# EasyEDA schematic SCH_Guava PCB.json
TITLE: Schematic; REV: 1.0; Date: 2022-01-08; Sheet: 1/1; Drawn By: PedroElFrijol; Company: Guava
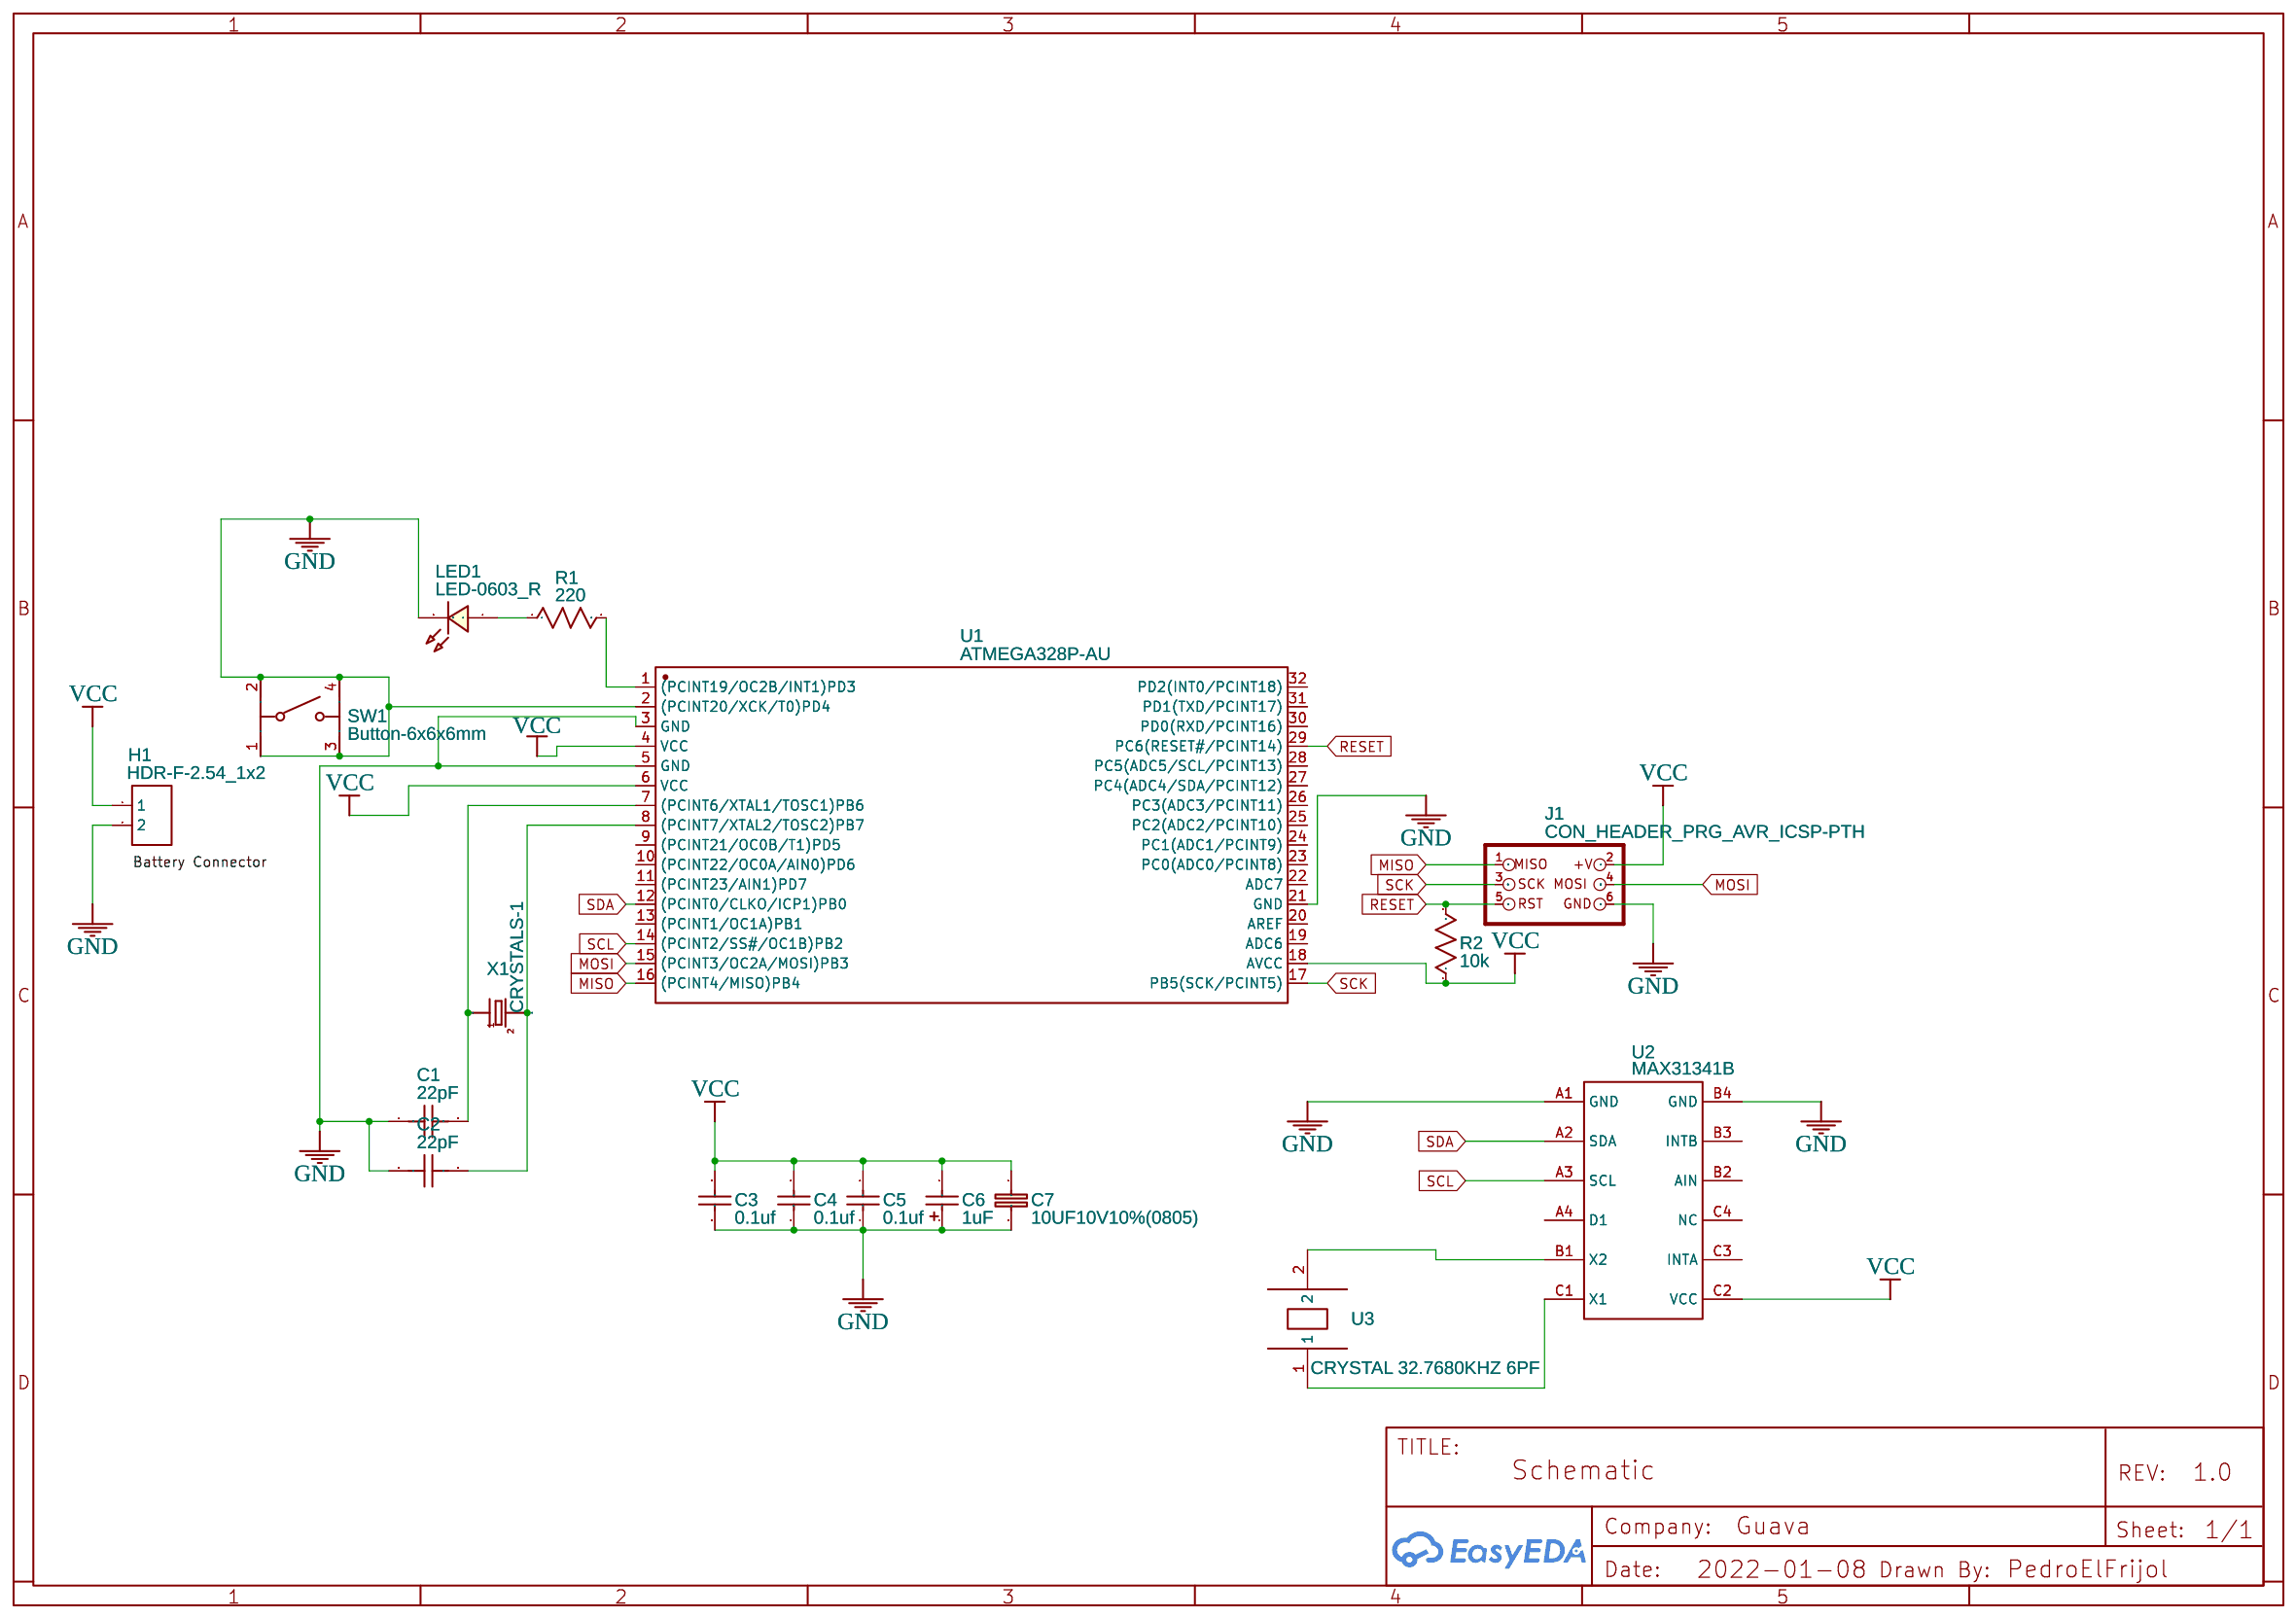
[diagram p0: schematic sheet]

## Parts
C1  22pF  [C0603]
C2  22pF  [C0603]
C3  0.1uf  [0805]
C4  0.1uf  [0805]
C5  0.1uf  [0805]
C6  1uF  [0805]
C7  10UF10V10%(0805)  [C0805]
H1  HDR-F-2.54_1x2  [HDR-F-2.54_1X2]
J1  CON_HEADER_PRG_AVR_ICSP-PTH  [HEADER_PRG_2X03]
LED1  LED-0603_R  [LED0603_RED]
R1  220  [R0603]
R2  10k  [R0603]
SW1  Button-6x6x6mm  [SW-TH_4P-L6.0-W6.0-P4.50-LS6.1]
U1  ATMEGA328P-AU  [TQFP-32_L7.0-W7.0-P0.80-LS9.0-BL]
U2  MAX31341B  [12-WLP]
U3  CRYSTAL 32.7680KHZ 6PF  [32.768KHZ CRYSTAL]
X1  CRYSTALS-1  [HCM49]

## Library data of the parts
C1 C2 = C_0603_US: Contributor: LCEDA_Lib
C3-C5 = 0.1uf: Supplier Part: undefined; Supplier: LCSC; Manufacturer: LCSC; Manufacturer Part: CT4-0805Y104M500
C6 = 1uF: Supplier: LCSC; Manufacturer: AVX; Manufacturer Part: TAP105K050SCS; Supplier Part: C52309
C7 = 10UF10V10%(0805): CAP-11330; Contributor: SparkFun
H1 = HDR-F-2.54_1x2: Supplier Part: C49661; Supplier: LCSC; Contributor: LCEDA_Lib
J1 = CON_HEADER_PRG_AVR_ICSP-PTH: 2x3 AVR ICSP programming header; Contributor: DangerousPrototype
LED1 = LED-0603_R: Manufacturer: EVERLIGHT(台湾亿光); Manufacturer Part: 19-217/R6C-AL1M2VY/3T; Supplier Part: C72044; Supplier: LCSC; Contributor: LCEDA_01
R1 R2 = R_0603_US: Contributor: LCEDA_Lib
SW1 = Button-6x6x6mm: Supplier Part: C71836; Supplier: LCSC; Manufacturer: BBJ; Manufacturer Part: Switch,6*6*6Plastic head,260G, 0.25mm,Straight line
U1 = ATMEGA328P-AU: Supplier: LCSC; Manufacturer: MICROCHIP; Supplier Part: C14877; JLCPCB Part Class: Basic Part
U2 = MAX31341B: Manufacturer: Maxim Integrated; Manufacturer Part: MAX31341BEWC+; Supplier: Digi-Key; Supplier Part: MAX31341BEWC+-ND; link: https://www.digikey.com/product-detail/en/maxim-integrated/MAX31341BEWC/MAX31341BEWC-ND/10258733; Contributor: bradbock
U3 = CRYSTAL 32.7680KHZ 6PF T/H: Manufacturer: Citizen Finedevice Co Ltd; Manufacturer Part: CFS-20632768DZBB; Supplier: Digi-Key; Supplier Part: 300-8301-ND; link: https://www.digikey.com/product-detail/en/citizen-finedevice-co-ltd/CFS-20632768DZBB/300-8301-ND/862578; Contributor: mneal
X1 = CRYSTALS-1

## Nets
GND: C1.1 C2.1 C3.1 C4.1 C5.1 C6.1 C7.2 H1.2 J1.6(GND) LED1.2 SW1.1 SW1.2 SW1.3 SW1.4 U1.2((PCINT20/XCK/T0)PD4) U1.3(GND) U1.5(GND) U1.21(GND) U2.A1(GND) U2.B4(GND)
VCC: C3.2 C4.2 C5.2 C6.2 C7.1 H1.1 J1.2(+V) R2.1 U1.4(VCC) U1.6(VCC) U1.18(AVCC) U2.C2(VCC)
MISO: J1.1(MISO) U1.16((PCINT4/MISO)PB4)
MOSI: J1.4(MOSI) U1.15((PCINT3/OC2A/MOSI)PB3)
RESET: J1.5(RST) R2.2 U1.29(PC6(RESET#/PCINT14))
SCK: J1.3(SCK) U1.17(PB5(SCK/PCINT5))
SCL: U1.14((PCINT2/SS#/OC1B)PB2) U2.A3(SCL)
SDA: U1.12((PCINT0/CLKO/ICP1)PB0) U2.A2(SDA)
Net-(C1-2): C1.2 U1.7((PCINT6/XTAL1/TOSC1)PB6) X1.1
Net-(C2-2): C2.2 U1.8((PCINT7/XTAL2/TOSC2)PB7) X1.2
Net-(LED1-1): LED1.1 R1.1
Net-(R1-2): R1.2 U1.1((PCINT19/OC2B/INT1)PD3)
Net-(U2-B1): U2.B1(X2) U3.2
Net-(U2-C1): U2.C1(X1) U3.1

Not connected (* = marked no-connect by the designer): U1 9((PCINT21/OC0B/T1)PD5) 10((PCINT22/OC0A/AIN0)PD6) 11((PCINT23/AIN1)PD7) 13((PCINT1/OC1A)PB1) 19(ADC6) 20(AREF) 22(ADC7) 23(PC0(ADC0/PCINT8)) 24(PC1(ADC1/PCINT9)) 25(PC2(ADC2/PCINT10)) 26(PC3(ADC3/PCINT11)) 27(PC4(ADC4/SDA/PCINT12)) 28(PC5(ADC5/SCL/PCINT13)) 30(PD0(RXD/PCINT16)) 31(PD1(TXD/PCINT17)) 32(PD2(INT0/PCINT18)); U2 A4(D1) B2(AIN) B3(INTB) C3(INTA) C4(NC)
